# EAGLE design espnano (EAGLE 8.6.1)
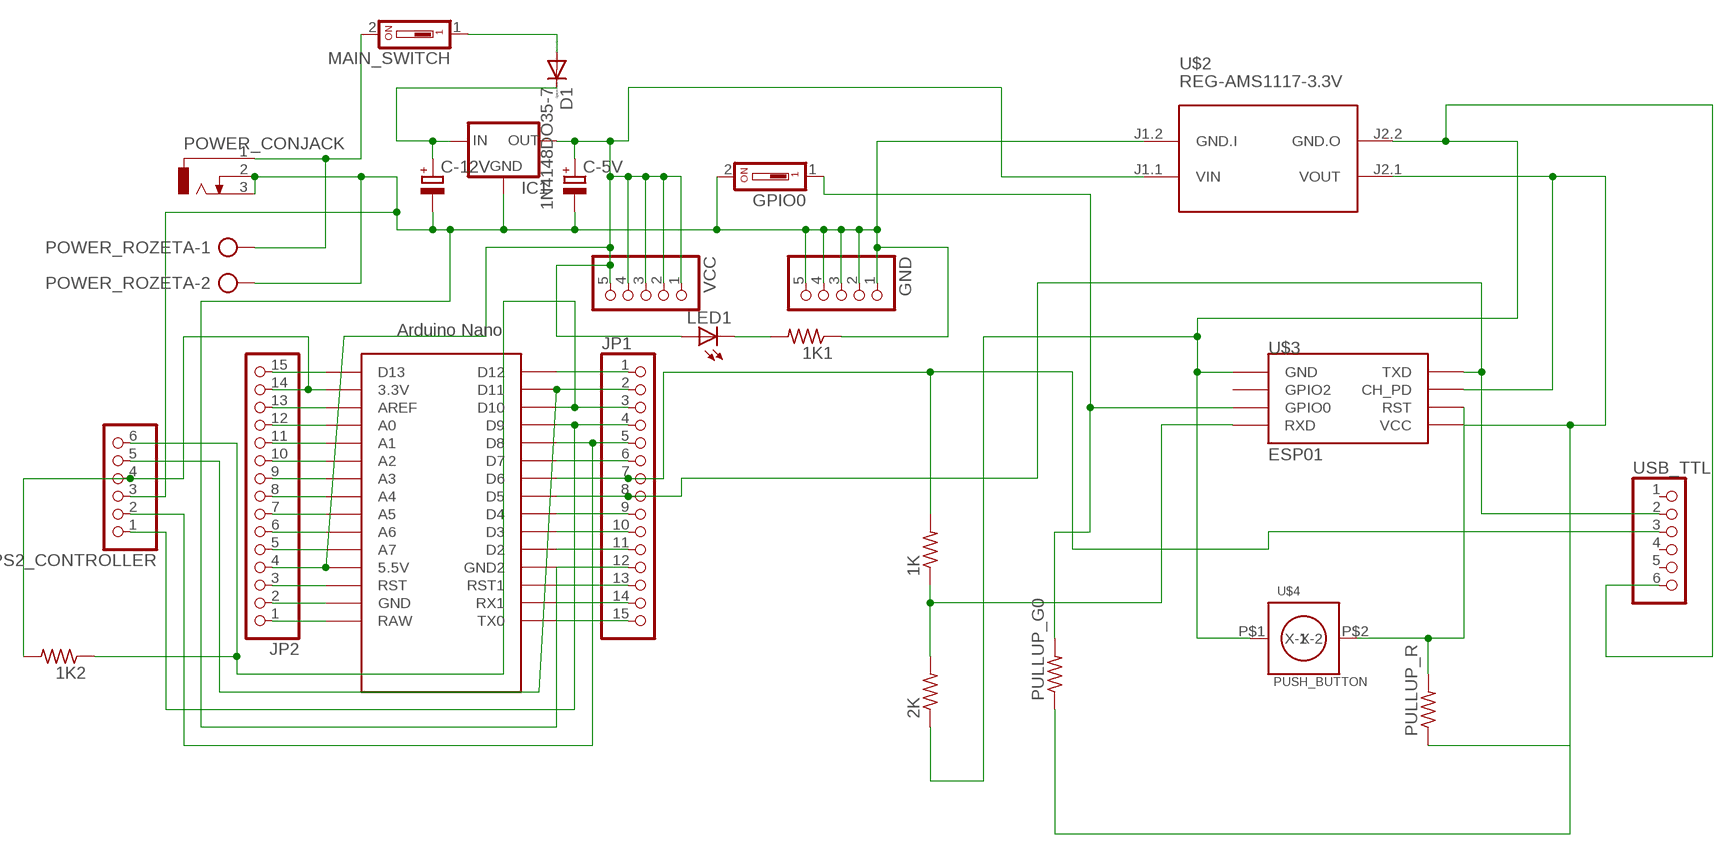
[diagram p0: schematic, sheet 1]

## Parts
1K  R-US_0204/7  [0204/7]
1K1  R-US_0204/7  [0204/7]
1K2  R-US_0204/7  [0204/7]
2K  R-US_0204/7  [0204/7]
C-5V  CPOL-EUE2,5-6E  [E2,5-6E]
C-12V  CPOL-EUE2,5-6E  [E2,5-6E]
D1  1N4148DO35-7  [DO35-7]
GND  PINHD-1X5  [1X05]
GPIO0  DS01  [DS-01]
IC1  78XXS  [78XXS]
JP1  PINHD-1X15  [1X15]
JP2  PINHD-1X15  [1X15]
LED1  LED5MM  [LED5MM]
MAIN_SWITCH  DS01  [DS-01]
POWER_CONJACK  DCJ0303  [DCJ0303]
POWER_ROZETA  AK300/2  [AK300/2]
PS2_CONTROLLER  PINHD-1X6  [1X06]
PULLUP_G0  R-US_0204/7  [0204/7]
PULLUP_R  R-US_0204/7  [0204/7]
U$1  NANO  [NANO]
U$2  REG-AMS1117-3.3V  [REG-AMS1117]
U$3  ESP01  [ESP01]
U$4  PUSH_BUTTON  [DIP2]
USB_TTL  PINHD-1X6  [1X06]
VCC  PINHD-1X5  [1X05]

## Nets
N$2: JP2.15 U$1.D13
N$3: JP1.2 PS2_CONTROLLER.5 U$1.D11
N$4: JP1.4 PS2_CONTROLLER.1 U$1.D9
N$6: JP1.6 U$1.D7
N$7: JP1.8 U$1.D5 U$3.TX(TXD) USB_TTL.2
N$8: C-12V.+ D1.C IC1.IN
N$9: JP1.9 U$1.D4
N$10: JP1.10 U$1.D3
N$11: JP1.11 U$1.D2
N$12: 1K1.1 C-5V.- C-12V.- GND.1 GND.2 GND.3 GND.4 GND.5 GPIO0.2 IC1.GND JP1.12 POWER_CONJACK.2 POWER_CONJACK.3 POWER_ROZETA.2 PS2_CONTROLLER.3 U$1.GND1(GND2) U$2.J1.2(GND.I)
N$13: JP1.13 U$1.RST1
N$14: JP1.14 U$1.RX1
N$15: JP1.15 U$1.TX0
N$16: JP2.1 U$1.RAW
N$17: JP2.2 U$1.GND
N$18: JP2.3 U$1.RST
N$20: JP2.5 U$1.A7
N$21: JP2.6 U$1.A6
N$22: JP2.7 U$1.A5
N$23: JP2.8 U$1.A4
N$24: JP2.9 U$1.A3
N$25: JP2.10 U$1.A2
N$26: JP2.11 U$1.A1
N$27: JP2.12 U$1.A0
N$28: JP2.13 U$1.AREF
N$29: JP1.5 PS2_CONTROLLER.2 U$1.D8
N$30: 1K2.1 JP1.3 PS2_CONTROLLER.6 U$1.D10
N$32: MAIN_SWITCH.2 POWER_CONJACK.1 POWER_ROZETA.1
N$33: 1K.2 JP1.7 U$1.D6 USB_TTL.3
N$35: 2K.1 U$2.J2.2(GND.O) U$3.GND U$4.P$1(X-1) USB_TTL.6
N$36: PULLUP_G0.1 PULLUP_R.1 U$2.J2.1(VOUT) U$3.CH_PD U$3.VCC
N$38: D1.A MAIN_SWITCH.1
N$39: GPIO0.1 PULLUP_G0.2 U$3.GPIO0
N$40: 1K1.2 LED1.K(C)
N$41: 1K.1 2K.2 U$3.RX(RXD)
N$42: 1K2.2 JP2.14 PS2_CONTROLLER.4 U$1.3.3V
N$44: JP1.1 U$1.D12
N$45: PULLUP_R.2 U$3.RST U$4.P$2(X-2)
VCC: C-5V.+ IC1.OUT JP2.4 LED1.A U$1.5V(5.5V) U$2.J1.1(VIN) VCC.1 VCC.2 VCC.3 VCC.4 VCC.5
Unconnected: U$3.GPIO2 USB_TTL.1 USB_TTL.4 USB_TTL.5

## Library data of the parts
1K 1K1 1K2 2K PULLUP_G0 PULLUP_R = rcl:R-US_: RESISTOR, American symbol; SPICEPREFIX: R
C-5V C-12V = rcl:CPOL-EU: POLARIZED CAPACITOR, European symbol; SPICEPREFIX: C
D1 = diode:1N4148: DIODE high speed (Philips)
GND VCC = pinhead:PINHD-1X5: PIN HEADER
GPIO0 MAIN_SWITCH = switch-dil:DS01: DIL/CODE SWITCH; OC_FARNELL: unknown; OC_NEWARK: unknown
IC1 = v-reg:78XXS: VOLTAGE REGULATOR
JP1 JP2 = pinhead:PINHD-1X15: PIN HEADER
LED1 = led:LED: LED OSRAM: - CHIPLED LG R971, LG N971, LY N971, LG Q971, LY Q971, LO R971, LY R971 LH N974, LH R974 LS Q976, LO Q976, LY Q976 LO Q996 - Hyper CHIPLED LW Q18S LB Q993, LB Q99A, LB R99A - SideLED LS A670, LO A670, LY A670, LG A670, LP A670 LB A673, LV A673, LT A673, LW A673 LH A674 LY A675 LS A676, LA A676, LO A676, LY A676, LW A676 LS A679, LY A679, LG A679 - Hyper Micro SIDELED® LS Y876, LA Y876, LO Y876, LY Y876 LT Y87S - SmartLED LW L88C, LW L88S LB L89C, LB L89S, LG L890 LS L89K, LO L89K, LY L89K LS L896, LA L896, LO L896, LY L896 - TOPLED LS T670, LO T670, LY T670, LG T670, LP T670 LSG T670, LSP T670, LSY T670, LOP T670, LYG T670 LG T671, LOG T671, LSG T671 LB T673, LV T673, LT T673, LW T673 LH T674 LS T676, LA T676, LO T676, LY T676, LB T676, LH T676, LSB T676, LW T676 LB T67C, LV T67C, LT T67C, LS T67K, LO T67K, LY T67K, LW E67C LS E67B, LA E67B, LO E67B, LY E67B, LB E67C, LV E67C, LT E67C LW T67C LS T679, LY T679, LG T679 LS T770, LO T770, LY T770, LG T770, LP T770 LB T773, LV T773, LT T773, LW T773 LH T774 LS E675, LA E675, LY E675, LS T675 LS T776, LA T776, LO T776, LY T776, LB T776 LHGB T686 LT T68C, LB T68C - Hyper Mini TOPLED® LB M676 - Mini TOPLED Santana® LG M470 LS M47K, LO M47K, LY M47K Source: http://www.osram.convergy.de LUXEON: - LUMILED® LXK2-PW12-R00, LXK2-PW12-S00, LXK2-PW14-U00, LXK2-PW14-V00 LXK2-PM12-R00, LXK2-PM12-S00, LXK2-PM14-U00 LXK2-PE12-Q00, LXK2-PE12-R00, LXK2-PE12-S00, LXK2-PE14-T00, LXK2-PE14-U00 LXK2-PB12-K00, LXK2-PB12-L00, LXK2-PB12-M00, LXK2-PB14-N00, LXK2-PB14-P00, LXK2-PB14-Q00 LXK2-PR12-L00, LXK2-PR12-M00, LXK2-PR14-Q00, LXK2-PR14-R00 LXK2-PD12-Q00, LXK2-PD12-R00, LXK2-PD12-S00 LXK2-PH12-R00, LXK2-PH12-S00 LXK2-PL12-P00, LXK2-PL12-Q00, LXK2-PL12-R00 Source: www.luxeon.com KINGBRIGHT: KA-3528ASYC Source: www.kingbright.com
POWER_CONJACK = con-jack:DCJ0303: DC POWER JACK Source: DCJ0303.pdf; OC_FARNELL: unknown; OC_NEWARK: unknown
POWER_ROZETA = con-ptr500:AK300/2: CONNECTOR; OC_FARNELL: unknown; OC_NEWARK: unknown
PS2_CONTROLLER USB_TTL = pinhead:PINHD-1X6: PIN HEADER
U$1 = Arduino-clone:NANO: Arduino Nano
U$2 = diy-modules:REG-AMS1117-*: Linear Regulator based on AMS1117 chip
U$3 = esp8266modules:ESP01: ESP8266 Wifi module 01
U$4 = PUSH_BUTTON:PUSH_BUTTON

## Board
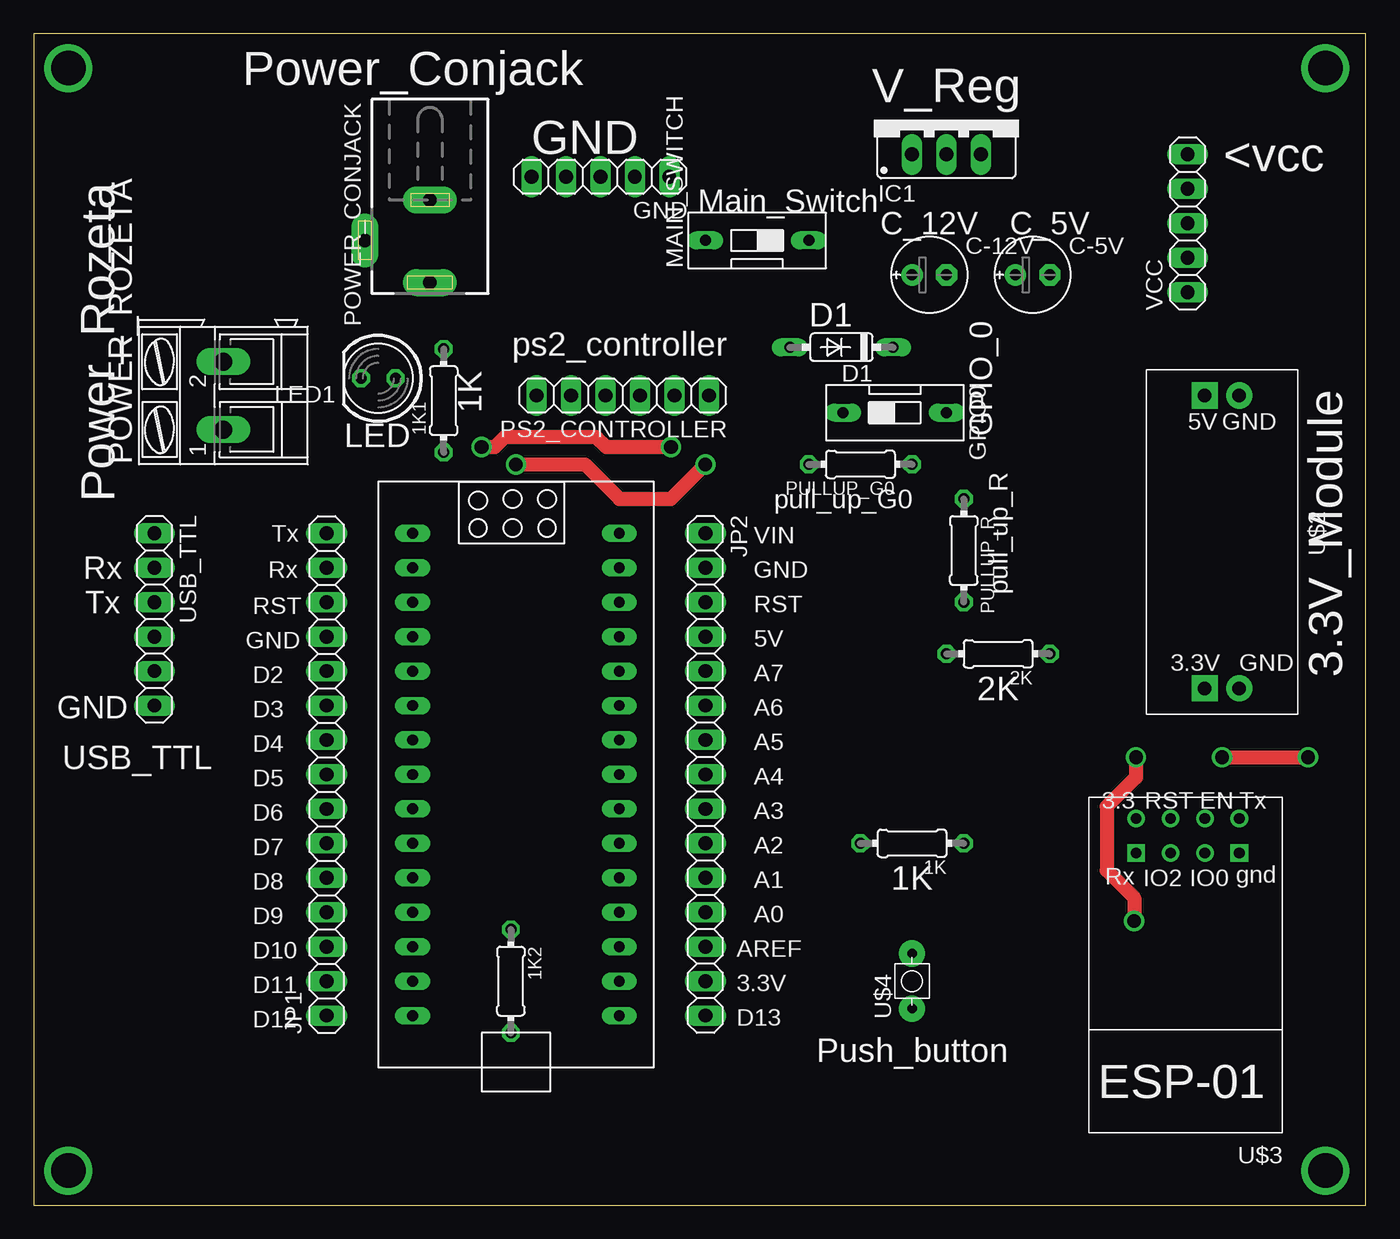
[diagram p1: board, top side]
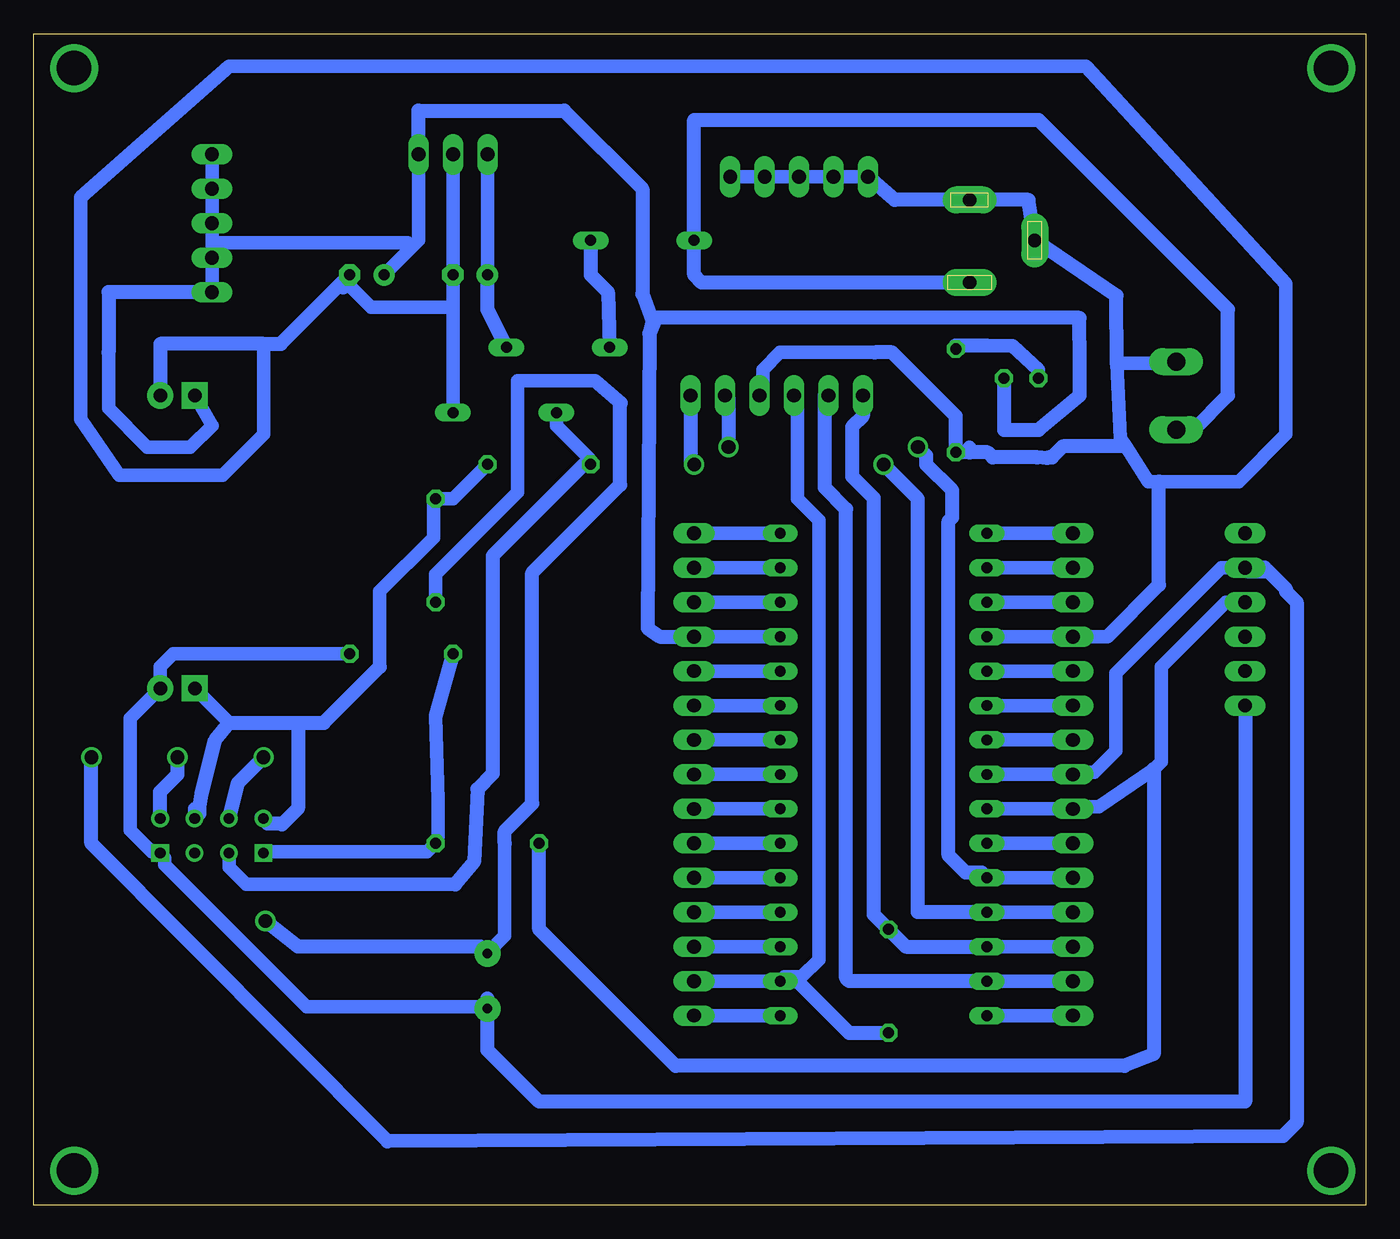
[diagram p2: board, bottom side, seen from below]

Size 98.22 x 86.35 mm. Coordinates in mm from the lower left corner, seen from the top.
Outline: 0,0 98.22,0 98.22,86.35 0,86.35 0,0
Copper layers (1*16): Top 0.035mm / dielectric 1.5mm / Bottom 0.035mm
Design rules "default *": minimum track width 1mm, minimum drill 1mm, track to track 1mm, track to pad 1mm, pad to pad 6mil, via to via 6mil, smd to smd 6mil, copper to edge 1mm, drill to drill 6mil, minimum pad ring 10mil, minimum via ring 8mil, stop-mask expansion 4mil, vias tented up to drill 0mil, thermal gap 10mil

### Footprints (pad centres in the part's own frame; a part is rotated, then mirrored left to right if it is on the bottom)
0204/7 = drill 0.813 octagon: 1 -3.81,0; 2 3.81,0
E2,5-6E = drill 0.813 pad 1.575: + -1.27,0 | drill 0.813 pad 1.575 octagon: - 1.27,0
DO35-7 = drill 0.813 long: A 3.81,0; C -3.81,0
1X05 = drill 1.016 long: 1 -5.08,0; 2 -2.54,0; 3 0,0; 4 2.54,0; 5 5.08,0
DS-01 = drill 0.813 long: 1 0,-3.81; 2 0,3.81
78XXS = drill 1.016 long: GND 0,-2.54; IN -2.54,-2.54; OUT 2.54,-2.54
1X15 = drill 1.016 long: 1 -17.78,0; 2 -15.24,0; 3 -12.7,0; 4 -10.16,0; 5 -7.62,0; 6 -5.08,0; 7 -2.54,0; 8 0,0; 9 2.54,0; 10 5.08,0; 11 7.62,0; 12 10.16,0; 13 12.7,0; 14 15.24,0; 15 17.78,0
LED5MM = drill 0.813 octagon: A -1.27,0; K 1.27,0
DCJ0303 = drill 1 pad 2 long: 1 0,3.1; 2 4.8,0; 3 0,-3
AK300/2 = drill 1.321 long: 1 -2.515,0; 2 2.489,0
1X06 = drill 1.016 long: 1 -6.35,0; 2 -3.81,0; 3 -1.27,0; 4 1.27,0; 5 3.81,0; 6 6.35,0
NANO = drill 0.8 long: 3.3V -10.16,24.13; 5V -10.16,-1.27; A0 -10.16,19.05; A1 -10.16,16.51; A2 -10.16,13.97; A3 -10.16,11.43; A4 -10.16,8.89; A5 -10.16,6.35; A6 -10.16,3.81; A7 -10.16,1.27; AREF -10.16,21.59; D2 5.08,1.27; D3 5.08,3.81; D4 5.08,6.35; D5 5.08,8.89; D6 5.08,11.43; D7 5.08,13.97; D8 5.08,16.51; D9 5.08,19.05; D10 5.08,21.59; D11 5.08,24.13; D12 5.08,26.67; D13 -10.16,26.67; GND -10.16,-6.35; GND1 5.08,-1.27; RAW -10.16,-8.89; RST -10.16,-3.81; RST1 5.08,-3.81; RX1 5.08,-6.35; TX0 5.08,-8.89
REG-AMS1117 = drill 1 pad 1.93 square: J1.1 -13.97,-1.27; J2.1 7.62,-1.27 | drill 1 pad 1.93: J1.2 -13.97,1.27; J2.2 7.62,1.27
ESP01 = drill 0.8: CH_PD -1.285,-8.178; GPIO0 1.255,-5.638; GPIO2 -1.285,-5.638; RST 1.255,-8.178; TX -3.825,-8.178; VCC 3.795,-8.178 | drill 0.8 square: GND -3.825,-5.638; RX 3.795,-5.638
DIP2 = drill 0.7 pad 1.93: P$1 -5.842,1.27; P$2 -1.778,1.27

### Placement (x,y rotation side)
1K  64.77,26.67 180 top
1K1  30.23,59.31 90 top
1K2  35.18,16.51 270 top
2K  71.12,40.64 180 top
C-5V  73.66,68.58 0 top
C-12V  66.04,68.58 0 top
D1  59.56,63.25 180 top
GND  41.78,75.82 180 top
GPIO0  63.5,58.42 270 top
IC1  67.31,80.01 0 top
JP1  21.59,31.75 90 top
JP2  49.53,31.75 270 top
LED1  25.4,60.96 180 top
MAIN_SWITCH  53.34,71.12 90 top
POWER_CONJACK  29.21,71.12 180 top
POWER_ROZETA  13.97,59.69 90 top
PS2_CONTROLLER  43.43,59.69 180 top
PULLUP_G0  60.96,54.61 180 top
PULLUP_R  68.58,48.26 270 top
U$1  33.02,40.64 180 top
U$2  87.63,45.72 270 top
U$3  85.09,20.32 180 top
U$4  66.04,20.32 90 top
USB_TTL  8.89,43.18 270 top
VCC  85.09,72.39 90 top

### Tracks (layer width: path | path; a pad name or v marks a point on that pad's centre or on a via)
N$2
  Bottom 1: JP2.15 U$1.D13
N$3
  Bottom 1: JP1.2 U$1.D11
  Bottom 1.016: U$1.D11 38.1,16.51 38.31,16.73 38.31,51.31 39.89,52.89 39.89,59.69 PS2_CONTROLLER.5
N$4  (via drill 1 pad 1.3)
  Top 1.016: v35.56,54.61 40.64,54.61 43.18,52.07 46.99,52.07 v49.53,54.61
  Bottom 1: JP1.4 U$1.D9
  Bottom 1.016: U$1.D9 33.02,21.59 33.02,52.07 v35.56,54.61 | PS2_CONTROLLER.1 49.78,54.86 v49.53,54.61
N$6
  Bottom 1: JP1.6 U$1.D7
N$7  (via drill 1)
  Top 1.016: v87.63,33.02 v93.98,33.02
  Bottom 1: USB_TTL.2 10.64,46.99 18.41,39.21 18.41,33.5 20,31.91 21.11,31.91 JP1.8 U$1.D5
  Bottom 1.016: 7.19,46.72 8.62,46.72 USB_TTL.2 7.46,46.99 7.19,46.72 | v93.98,33.02 93.98,26.67 72.14,4.7 6.1,5.08 5.08,6.1 5.08,44.45 5.86,45.23 5.86,45.39 7.19,46.72 | U$3.TX 88.92,30.47 87.63,31.75 v87.63,33.02
N$8
  Bottom 1: C-12V.+ IC1.IN
  Bottom 1.016: D1.C 64.77,66.04 C-12V.+
N$9
  Bottom 1: JP1.9 U$1.D4
N$10
  Bottom 1: JP1.10 U$1.D3
N$11
  Bottom 1: JP1.11 U$1.D2
N$12
  Bottom 1: 67.31,66.2 C-12V.- IC1.GND | 67.31,66.2 GPIO0.2 | 74.93,67.79 C-5V.- | 74.93,67.79 73.34,66.2 67.31,66.2 | 75.41,67.63 74.93,67.79 | GND.5 GND.4 GND.3 GND.2 GND.1 | POWER_ROZETA.2 15.24,62.07 18.35,62.07 18.1,56.55 17.7,55.93 16.03,53.34 15.24,53.34 9.37,53.34 5.87,56.83 5.87,67.95 20.64,83.98 83.82,83.98 94.77,74.3 94.77,57.94 91.92,53.82 84.3,53.82 81.28,56.83 81.28,63.5 | U$1.GND1 JP1.12 19.05,41.91 | 36.2,62.87 43.18,62.87 44.45,61.59 44.45,59.69 PS2_CONTROLLER.3 | 29.21,55.88 29.21,55.5
  Bottom 1.016: 15.24,53.34 15.24,45.72 19.05,41.91 | 18.35,62.07 18.38,67.06 POWER_CONJACK.2 24.87,74.12 POWER_CONJACK.3 34.75,74.12 GND.5 | 17.7,55.93 22.34,55.93 23.14,55.13 23.4,55.13 23.48,55.07 24.22,55.13 27.51,55.13 27.87,55.5 29.21,55.5 1K1.1 30.23,58.17 34.92,62.87 36.2,62.87 | U$2.J1.2 88.9,63.5 81.28,63.5 80.01,63.5 C-5V.-
N$13
  Bottom 1: JP1.13 U$1.RST1
N$14
  Bottom 1: JP1.14 U$1.RX1
N$15
  Bottom 1: JP1.15 U$1.TX0
N$16
  Bottom 1: JP2.1 U$1.RAW
N$17
  Bottom 1: JP2.2 U$1.GND
N$18
  Bottom 1: JP2.3 U$1.RST
N$19  (via drill 2.54)
  other vias: 2.54,83.82
N$20
  Bottom 1: JP2.5 U$1.A7
N$21
  Bottom 1: JP2.6 U$1.A6
N$22
  Bottom 1: JP2.7 U$1.A5
N$23
  Bottom 1: JP2.8 U$1.A4
N$24
  Bottom 1: JP2.9 U$1.A3
N$25
  Bottom 1: JP2.10 U$1.A2
N$26
  Bottom 1: JP2.11 U$1.A1
N$27
  Bottom 1: JP2.12 U$1.A0
N$28
  Bottom 1: JP2.13 U$1.AREF
N$29  (via drill 1 pad 1.3)
  Top 1.016: v46.99,55.88 42.22,55.88 41.48,56.63 34.73,56.63 33.98,55.88 v33.02,55.88
  Bottom 1: JP1.5 U$1.D8
  Bottom 1.016: U$1.D8 28.32,24.51 29.49,24.51 30.76,25.77 30.76,50.43 30.48,50.7 30.48,52.69 32.39,54.6 32.39,55.25 v33.02,55.88 | PS2_CONTROLLER.2 46.99,59.44 v46.99,55.88
N$30
  Bottom 1: JP1.3 U$1.D10
  Bottom 1.016: PS2_CONTROLLER.6 37.08,58.17 37.88,57.37 37.88,53.73 36.3,52.15 36.3,21.44 1K2.1 33.91,19.05 U$1.D10
N$31  (via drill 2.54)
  other vias: 95.25,83.82
N$32
  Bottom 1.016: POWER_CONJACK.1 48.97,68.02 49.53,68.58 MAIN_SWITCH.2 49.53,80.01 24.13,80.01 10.16,66.04 10.16,59.69 12.68,57.17 POWER_ROZETA.1
N$33
  Bottom 1: USB_TTL.3 10.32,44.45 15.08,39.69 15.08,32.7 15.64,32.15 19.68,29.37 21.11,29.37 JP1.7 U$1.D6
  Bottom 1.016: 15.64,32.15 15.64,11.13 17.78,10.26 50.89,10.26 60.96,20.32 1K.2
N$34  (via drill 2.54)
  other vias: 2.54,2.54
N$35
  Bottom 1: 2K.1 87.95,40.64 88.9,39.69 U$2.J2.2 91.12,35.88 91.12,27.62 89.53,26.04 89.06,26.04 U$3.GND 88.58,25.56 88.58,25.08 78.11,14.61 65.25,14.61 U$4.P$1
  Bottom 1.016: USB_TTL.6 8.89,7.62 60.96,7.62 64.77,11.43 U$4.P$1 64.77,15.24
N$36
  Bottom 1: PULLUP_G0.1 67.31,52.07 PULLUP_R.1 68.74,51.59 68.74,49.21 72.71,45.24 72.71,39.69 | U$2.J2.1 83.82,35.56 | 81.44,28.58 U$3.VCC | 86.36,29.21 86.36,28.58 U$3.CH_PD
  Bottom 1.016: U$3.CH_PD 86,28.88 86,29.39 85.85,30.3 84.84,34.29 83.82,35.56 78.74,35.56 | 78.74,35.56 76.83,35.56 72.71,39.69 | 78.74,35.56 78.74,29.24 79.94,28.04 80.02,28.12 80.98,28.12 81.44,28.58
N$37  (via drill 2.54)
  other vias: 95.25,2.54
N$38
  Bottom 1.016: MAIN_SWITCH.1 57.15,68.58 55.88,67.31 D1.A
N$39
  Bottom 1: 67.15,23.65 82.55,23.65 83.82,24.92 83.82,25.88 U$3.GPIO0 | GPIO0.1 59.69,57.47 57.31,55.09 PULLUP_G0.2
  Bottom 1.016: PULLUP_G0.2 57.64,54.61 64.38,47.87 64.38,31.8 65.51,30.68 65.76,25.3 67.15,23.65
N$40
  Bottom 1: LED1.K 24.13,61.59 26.03,63.37 27.94,63.37
  Bottom 1.016: 27.94,63.37 30.23,63.37 1K1.2
N$41
  Bottom 1: U$3.RX 81.28,26.04 69.22,26.04 1K.1 68.42,27.15 68.42,29.84 68.58,36.04 2K.2
N$42
  Bottom 1: JP2.14 U$1.3.3V 42.86,16.83 41.59,16.83 40.32,18.1 40.32,50.48 41.91,52.07 41.91,59.69 PS2_CONTROLLER.4
  Bottom 1.016: U$1.3.3V 41.91,16.51 38.1,12.7 1K2.2
N$44
  Bottom 1: JP1.1 U$1.D12
N$45  (via drill 1)
  Top 1.016: v81.28,33.02 81.28,31.54 79.13,29.39 79.13,24.68 81.15,22.66 v81.15,20.96
  Bottom 1: PULLUP_R.2 68.58,46.51 62.55,52.55 62.55,60.77 56.83,60.77 54.93,59.12 | 63.5,27.3 63.5,26.67 63.5,19.84 64.77,18.57 U$4.P$2
  Bottom 1.016: U$4.P$2 65.28,19.05 78.74,19.05 v81.15,20.96 | U$3.RST 83.16,31.14 v81.28,33.02 | 63.5,26.67 63.5,27.56 61.47,29.59 61.47,46.61 54.98,53.09 54.98,59.06 54.93,59.12
VCC
  Bottom 1: 85.09,70.96 VCC.2 VCC.1 85.57,67.47 | 85.09,70.96 VCC.3 VCC.4 VCC.5 | U$2.J1.1 85.09,57.47 86.68,55.88 89.85,55.88 92.71,58.74 92.71,62.87 | IC1.OUT 69.85,71.12 70.33,70.64 | C-5V.+ 70.33,70.64 | 85.09,70.96 70.64,70.96 70.33,70.64 | JP2.4 U$1.5V
  Bottom 1.016: IC1.OUT 69.85,80.7 59.11,80.7 53.34,74.93 53.34,67.18 52.58,65.15 52.83,64.26 | 52.83,64.26 52.96,42.55 52.07,41.91 JP2.4 | LED1.A 26.67,57.15 24.13,57.15 21.08,59.69 21.08,62.08 21.11,65.41 52.32,65.41 52.83,64.26 | VCC.1 92.71,67.31 92.71,62.87

### Text on the board
tPlace: Power_Conjack | V_Reg | GND | <vcc | Main_Switch | C_12V | C_5V | D1 | Power_Rozeta | ps2_controller | GPIO_0 | 1K | 5V | GND | LED | pull_up_G0 | pull_up_R | 3.3V_Module | Tx | VIN | Rx | Rx | GND | Tx | RST | RST | GND | 5V | D2 | A7 | 3.3V | GND | 2K | GND | D3 | A6 | A5 | USB_TTL | D4 | D5 | A4 | 3.3 | RST | EN | Tx | D6 | A3 | D7 | A2 | 1K | Rx | IO2 | IO0 | gnd | D8 | A1 | D9 | A0 | D10 | AREF | D11 | 3.3V | D12 | D13 | Push_button